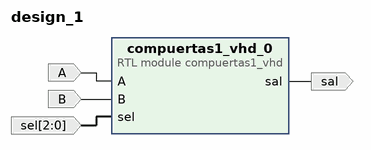
[diagram p0: block diagram of the top level]
# Vivado block design design_1, xc7a35tcpg236-1, Vivado 2026.1
create_bd_design design_1

create_bd_port -dir I A
create_bd_port -dir I B
create_bd_port -dir I -from 2 -to 0 sel
create_bd_port -dir O sal

create_bd_cell -type module -reference compuertas1_vhd compuertas1_vhd_0

# ---- connections ----

connect_bd_net -net A_0_1 [get_bd_ports A] [get_bd_pins compuertas1_vhd_0/A]
connect_bd_net -net B_0_1 [get_bd_ports B] [get_bd_pins compuertas1_vhd_0/B]
connect_bd_net [get_bd_pins compuertas1_vhd_0/sal] [get_bd_ports sal]
connect_bd_net -net sel_0_1 [get_bd_ports sel] [get_bd_pins compuertas1_vhd_0/sel]

validate_bd_design
save_bd_design
